# Altium schematic sheet MCU_LF.SchDoc
size A4; SheetNumber: 3; SheetTotal: 3
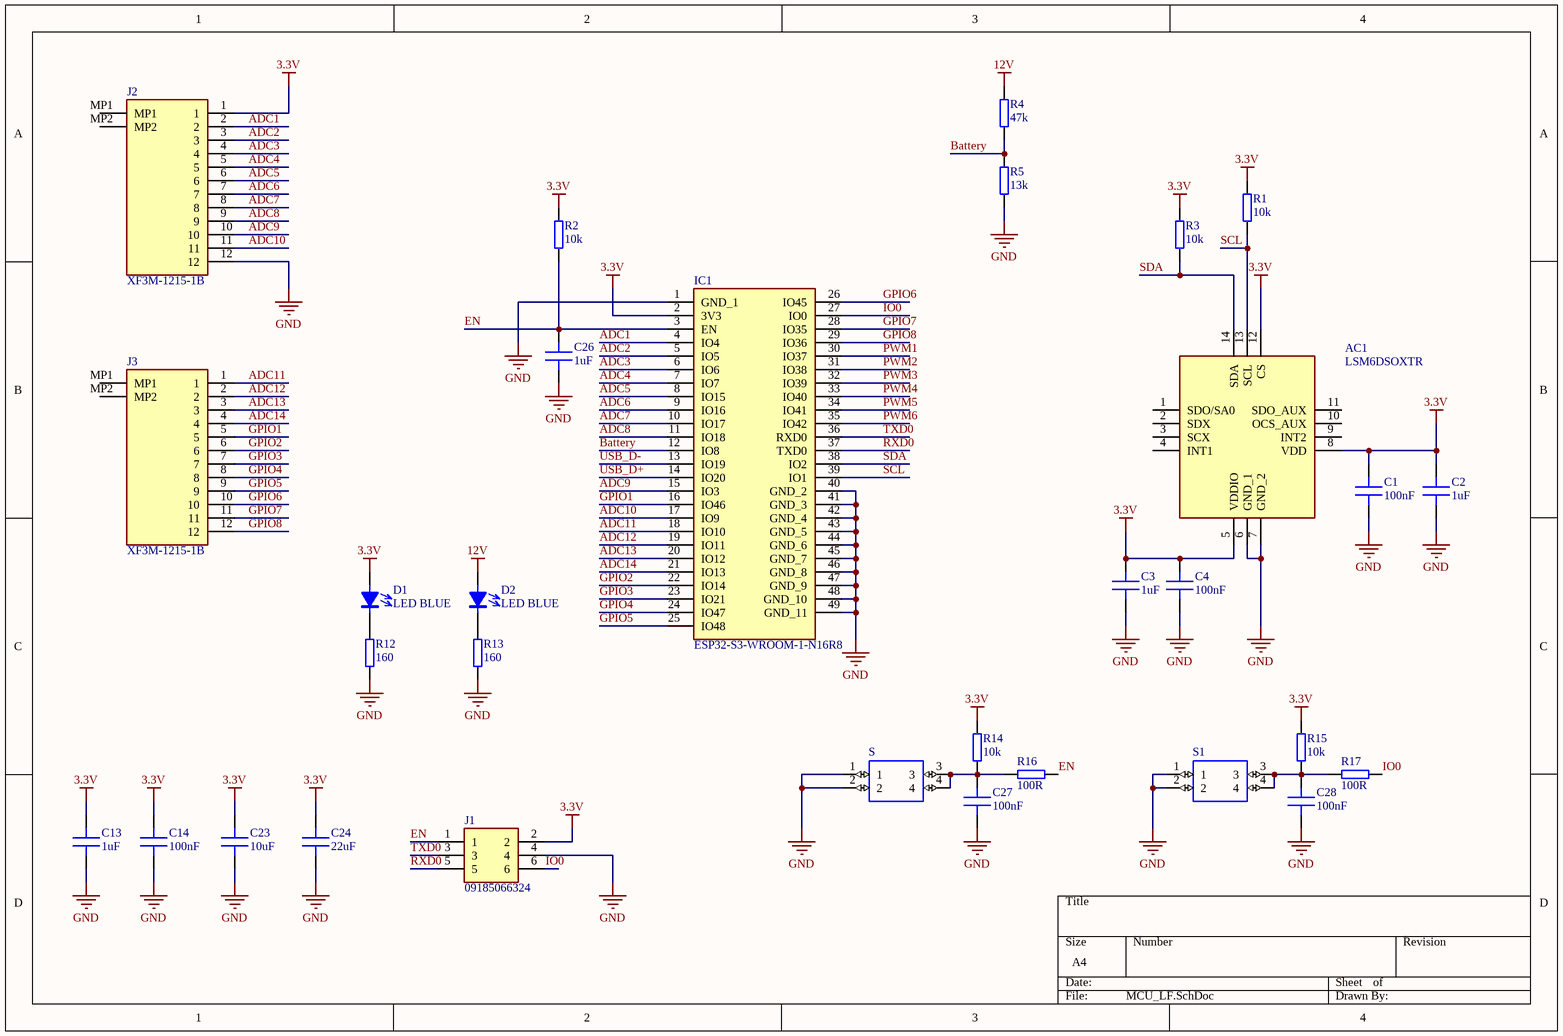
[diagram p0: MCU_LF.SchDoc]

## Parts
AC1  LSM6DSOXTR  [LGA-14_1]
C1  100nF  [C 0402]
C2  1uF  [C 0402]
C3  1uF  [C 0402]
C4  100nF  [C 0402]
C13  1uF  [C 0402]
C14  100nF  [C 0402]
C23  10uF  [C 0402]
C24  22uF  [C 0402]
C26  1uF  [C 0402]
C27  100nF  [C 0402]
C28  100nF  [C 0402]
D1  LED BLUE  [LED 0603 BLUE]
D2  LED BLUE  [LED 0603 BLUE]
IC1  ESP32-S3-WROOM-1-N16R8  [ESP32S3WROOM1N16R8]
J1  09185066324  [09185066324]
J2  XF3M-1215-1B  [XF3M12151B]
J3  XF3M-1215-1B  [XF3M12151B]
R1  10k  [R 0402]
R2  10k  [R 0402]
R3  10k  [R 0402]
R4  47k  [R 0402]
R5  13k  [R 0402]
R12  160  [R 0402]
R13  160  [R 0402]
R14  10k  [R 0402]
R15  10k  [R 0402]
R16  100R  [R 0402]
R17  100R  [R 0402]
S  PTS810SJK250SMTRLFS  [PTS810SJG250SMTRLFS]  (value not drawn)
S1  PTS810SJK250SMTRLFS  [PTS810SJG250SMTRLFS]  (value not drawn)

## Nets
3.3V: AC1.5(VDDIO) AC1.8(VDD) AC1.12(CS) C1.1 C2.1 C3.1 C4.1 C13.1 C14.1 C23.1 C24.1 D1.1 IC1.2(3V3) J1.2 J2.1 R1.2 R2.2 R3.2 R14.2 R15.2
12V: D2.1 R4.2
GND: AC1.6(GND_1) AC1.7(GND_2) C1.2 C2.2 C3.2 C4.2 C13.2 C14.2 C23.2 C24.2 C26.2 C27.2 C28.2 IC1.1(GND_1) IC1.40(GND_2) IC1.41(GND_3) IC1.42(GND_4) IC1.43(GND_5) IC1.44(GND_6) IC1.45(GND_7) IC1.46(GND_8) IC1.47(GND_9) IC1.48(GND_10) IC1.49(GND_11) J1.4 J2.12 R5.1 R12.1 R13.1 S.1 S.2 S1.1 S1.2
ADC1: IC1.4(IO4) J2.2
ADC2: IC1.5(IO5) J2.3
ADC3: IC1.6(IO6) J2.4
ADC4: IC1.7(IO7) J2.5
ADC5: IC1.8(IO15) J2.6
ADC6: IC1.9(IO16) J2.7
ADC7: IC1.10(IO17) J2.8
ADC8: IC1.11(IO18) J2.9
ADC9: IC1.15(IO3) J2.10
ADC10: IC1.17(IO9) J2.11
ADC11: IC1.18(IO10) J3.1
ADC12: IC1.19(IO11) J3.2
ADC13: IC1.20(IO12) J3.3
ADC14: IC1.21(IO13) J3.4
Battery: IC1.12(IO8) R4.1 R5.2
EN: C26.1 IC1.3(EN) J1.1 R2.1 R16.1
GPIO1: IC1.16(IO46) J3.5
GPIO2: IC1.22(IO14) J3.6
GPIO3: IC1.23(IO21) J3.7
GPIO4: IC1.24(IO47) J3.8
GPIO5: IC1.25(IO48) J3.9
GPIO6: IC1.26(IO45) J3.10
GPIO7: IC1.28(IO35) J3.11
GPIO8: IC1.29(IO36) J3.12
IO0: IC1.27(IO0) J1.6 R17.1
PWM1: IC1.30(IO37)
PWM2: IC1.31(IO38)
PWM3: IC1.32(IO39)
PWM4: IC1.33(IO40)
PWM5: IC1.34(IO41)
PWM6: IC1.35(IO42)
RXD0: IC1.37(TXD0) J1.5
SCL: AC1.13(SCL) IC1.39(IO1) R1.1
SDA: AC1.14(SDA) IC1.38(IO2) R3.1
TXD0: IC1.36(RXD0) J1.3
USB_D+: IC1.14(IO20)
USB_D-: IC1.13(IO19)
NetC27_1: C27.1 R14.1 R16.2 S.3 S.4
NetC28_1: C28.1 R15.1 R17.2 S1.3 S1.4
NetD1_2: D1.2 R12.2
NetD2_2: D2.2 R13.2

Not connected (* = marked no-connect by the designer): AC1 1(SDO/SA0) 2(SDX) 3(SCX) 4(INT1) 9(INT2) 10(OCS_AUX) 11(SDO_AUX); J2 MP1 MP2; J3 MP1 MP2

## Library data of the parts
AC1 = LSM6DSOXTR: Accelerometer; Manufacturer_Name: STMicroelectronics; Datasheet Link: https://www.st.com/resource/en/datasheet/lsm6dsox.pdf; Manufacturer_Part_Number: LSM6DSOXTR; Mouser Part Number: 511-LSM6DSOXTR; Mouser Price/Stock: https://www.mouser.co.uk/ProductDetail/STMicroelectronics/LSM6DSOXTR?qs=l7cgNqFNU1i9dcjzItLpVQ%3D%3D; Arrow Part Number: LSM6DSOXTR; Arrow Price/Stock: https://www.arrow.com/en/products/lsm6dsoxtr/stmicroelectronics?region=europe
C1-C4 C13 C14 C23 C24 C26-C28 = Capacitor: MLCC Capacitor
IC1 = ESP32-S3-WROOM-1-N16R8: Integrated Circuit; Manufacturer_Name: Espressif Systems; Datasheet Link: https://www.espressif.com/sites/default/files/documentation/esp32-s3-wroom-1_wroom-1u_datasheet_en.pdf; Height: 3.25mm; Manufacturer_Part_Number: ESP32-S3-WROOM-1-N16R8; Mouser Part Number: 356-ESP32S3WRM1N16R8; Mouser Price/Stock: https://www.mouser.co.uk/ProductDetail/Espressif-Systems/ESP32-S3-WROOM-1-N16R8?qs=Li%252BoUPsLEnvQc9gW6AMhZg%3D%3D
J1 = 09185066324: Connector; Manufacturer_Name: HARTING; Datasheet Link: https://b2b.harting.com/files/download/PRD/PDF_DS/PDF_DS_09185066324_EN.pdf; Manufacturer_Part_Number: 09185066324; Mouser Part Number: 617-09185066324; Mouser Price/Stock: https://www.mouser.co.uk/ProductDetail/HARTING/09185066324?qs=qa49y27LPCE%2F3ZplMsKEeQ%3D%3D; Arrow Part Number: 09185066324; Arrow Price/Stock: https://www.arrow.com/en/products/09185066324/harting?utm_currency=USD&region=europe
J2 J3 = XF3M-1215-1B: Connector; Manufacturer_Name: Omron Electronics; Datasheet Link: https://datasheet.lcsc.com/szlcsc/Omron-Electronics-XF3M-1215-1B_C231431.pdf; Height: 2mm; Manufacturer_Part_Number: XF3M-1215-1B; Mouser Part Number: 653-XF3M-1215-1B; Mouser Price/Stock: https://www.mouser.co.uk/ProductDetail/Omron-Electronics/XF3M-1215-1B?qs=1He0yLMpldAQYeSJcjbchQ%3D%3D; Arrow Part Number: XF3M-1215-1B; Arrow Price/Stock: https://www.arrow.com/en/products/xf3m-1215-1b/omron
R1-R5 R12-R17 = Resistor: General pourpouse resistor
S S1 = PTS810SJK250SMTRLFS: Tactile Switch SPST-NO Top Actuated Surface Mount; MF: C&K; SnapEDA_Link: https://www.snapeda.com/parts/PTS810SJK250SMTRLFS/C%26K/view-part/274682/?ref=snap; Package: None; Price: None; MP: PTS810SJK250SMTRLFS; Availability: Unavailable; Value: *